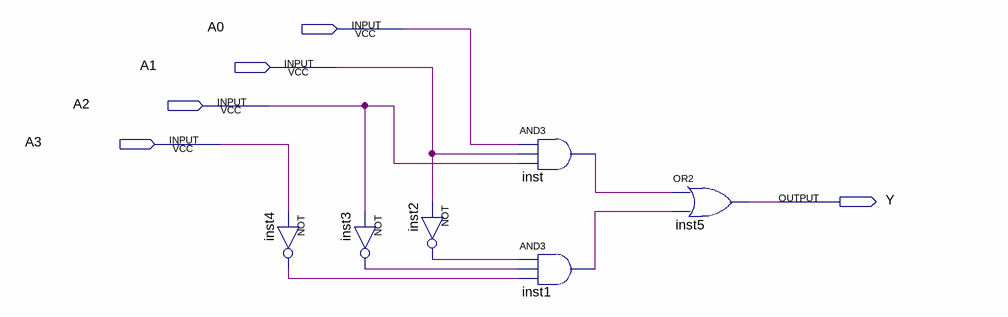
[diagram p0: schematic sheet]
// Quartus schematic Segment6.bdf as structural Verilog: 6 symbols, 5 pins
module Segment6 (
  input  A0,
  input  A1,
  input  A2,
  input  A3,
  output Y
);

  wire inst1_out, inst2_out, inst3_out, inst4_out, inst_out;

  not inst4 (inst4_out, A3);
  not inst3 (inst3_out, A2);
  not inst2 (inst2_out, A1);
  and inst (inst_out, A0, A1, A2);
  and inst1 (inst1_out, inst2_out, inst3_out, inst4_out);
  or inst5 (Y, inst_out, inst1_out);
endmodule
